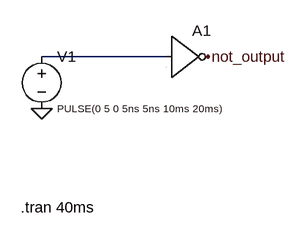
[diagram p0: schematic NOT gate.asc]
NOT gate.asc, the LTspice schematic file:
Version 4.1
SHEET 1 880 680
WIRE 160 112 -32 112
FLAG -32 192 0
FLAG 224 112 not_output
SYMBOL voltage -32 96 R0
WINDOW 3 24 96 Left 1
WINDOW 123 0 0 Left 0
WINDOW 39 0 0 Left 0
SYMATTR Value PULSE(0 5 0 5ns 5ns 10ms 20ms)
SYMATTR InstName V1
SYMBOL Digital\\inv 160 48 R0
SYMATTR InstName A1
TEXT -64 344 Left 2 !.tran 40ms

The netlist it stands for:
* NOT gate.asc
V1 N001 0 PULSE(0 5 0 5ns 5ns 10ms 20ms)
A1 N001 0 0 0 0 not_output 0 0 BUF
.tran 40ms
.backanno
.end